# Altium schematic sheet Microphone PreAmp.SchDoc
size A4; SheetNumber: 3; SheetTotal: 3
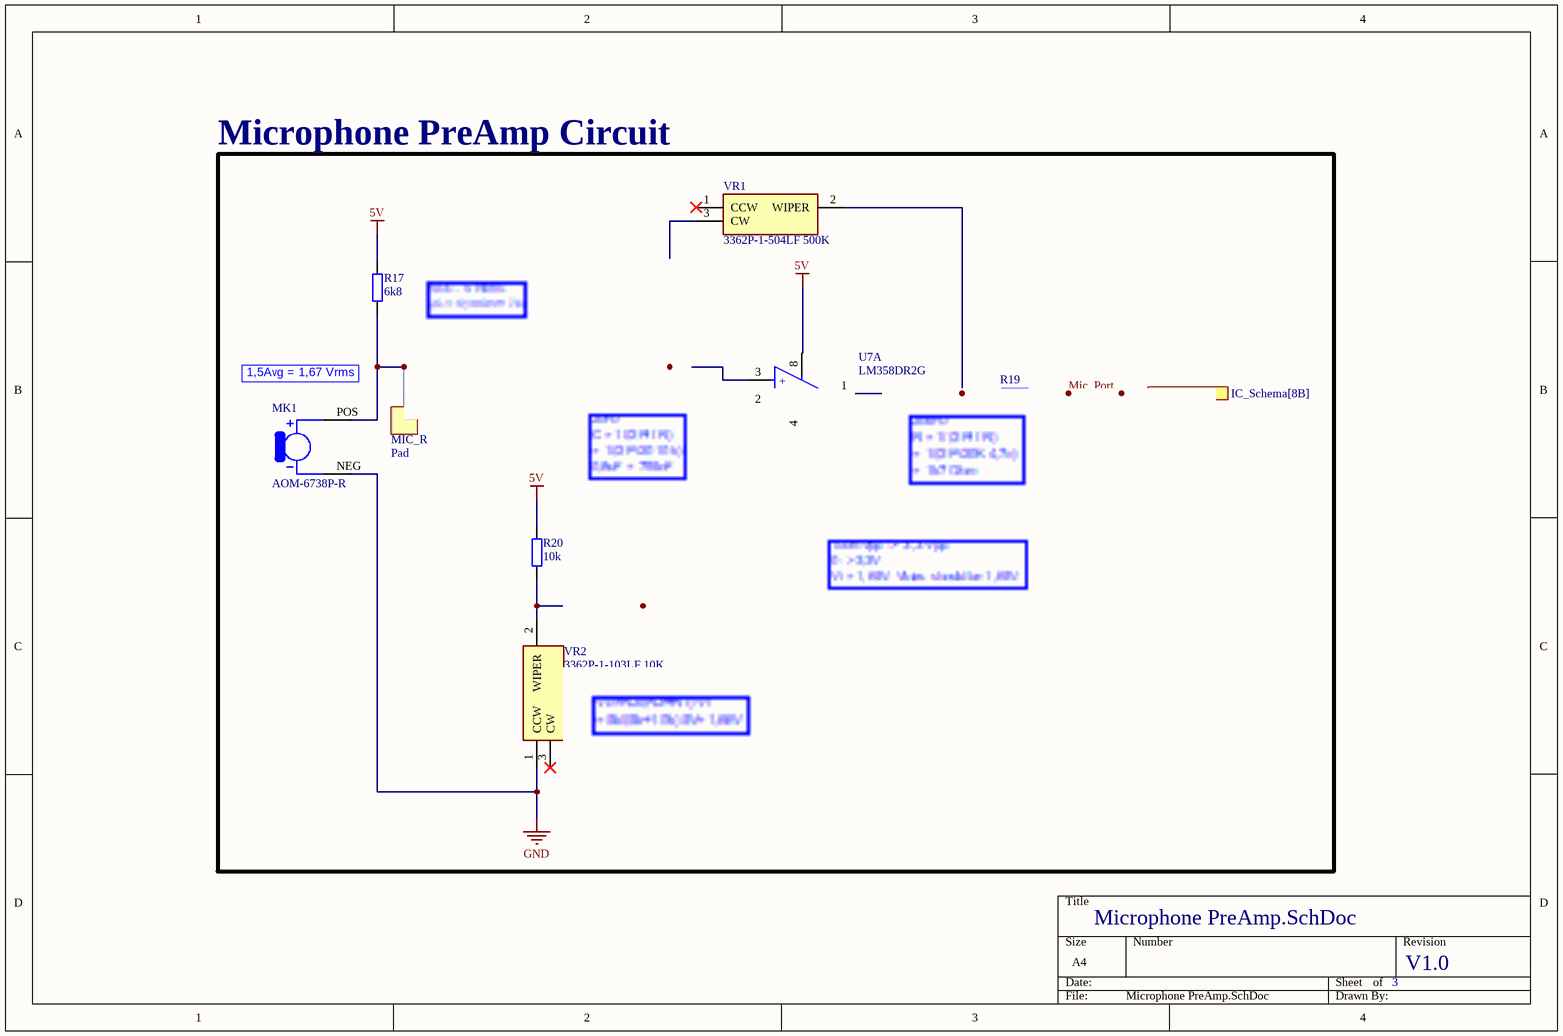
[diagram p0: Microphone PreAmp.SchDoc]

## Parts
Bias  Pad  [PAD_SQ_2MM]
C13  4u7  [CAP_0603]
C14  4n7  [CAP_0603]
MIC_O  Pad  [PAD_SQ_2MM]
MIC_R  Pad  [PAD_SQ_2MM]
MK1  AOM-6738P-R  [MIC_AOM-6738P-R]
R17  6k8  [RES_1206]
R18  10k  [RES_1206]
R19  1k7  [RES_1206]
R20  10k  [RES_1206]
U7  LM358DR2G  [FP-751-07-IPC_C]  (part A of 2)
VR1  3362P-1-504LF 500K  [3362P1504LF]
VR2  3362P-1-103LF 10K  [3362P1504LF]

## Blocks framed on the sheet
Microphone PreAmp Circuit: Bias C13 C14 MIC_O MIC_R MK1 R17-R20 U7 VR1 VR2

## Ports
Mic_Port (see IC_Schema[8B])

## Nets
5V: R17.1 R20.2 U7.8(VCC)
GND: C14.2 MK1.NEG U7.4(VEE/GND) VR2.1(CCW)
Mic_Port: C14.1 MIC_O.1 R19.1 ; port Mic_Port
NetBias_1: Bias.1 R20.1 U7.2(INPUT_A-) VR2.2(WIPER)
NetC13_1: C13.1 R18.2
NetC13_2: C13.2 MIC_R.1 MK1.POS R17.2
NetR18_1: R18.1 U7.3(INPUT_A+) VR1.3(CW)
NetR19_2: R19.2 U7.1(OUTPUT_A) VR1.2(WIPER)

Not connected (* = marked no-connect by the designer): VR1 1(CCW)*; VR2 3(CW)*

## Notes on the sheet
- V1.0
- (in symbol CMP-1310-00291-2, part A) +; -

## Library data of the parts
Bias MIC_O MIC_R = PAD_SQ_2MM: Test Point Square 2mm
C13 C14 = CAP_0603_50V: Capacitor SMD 0603 50V
MK1 = AOM-6738P-R: 30Hz ~ 15kHz Analog Microphone Electret Condenser 1.5V ~ 10V Omnidirectional _-38dB Â±3dB_ PC Pins; MF: PUI; SnapEDA_Link: https://www.snapeda.com/parts/AOM-6738P-R/PUI%20Audio%2C%20Inc./view-part/246102/?ref=snap; Package: PUI; MP: AOM-6738P-R; Value: *; Availability: Unavailable; Price: None
R17-R20 = RES_1206: Resistor SMD 1206
U7 = CMP-1310-00291-2: IC OPAMP GP 2 CIRCUIT 8SOIC; Gain Bandwidth Product: 1MHz; Number of Circuits: 2; Min Supply Voltage: 3V; Slew Rate: 0.6V/µs; Max Dual Supply Voltage: 16V; Common Mode Rejection Ratio: 65dB; Input Bias Current: 250nA; Min Dual Supply Voltage: 1.5V; Dual Supply Voltage: 9V; Operating Supply Current: 1.5mA; Output Current: 40mA; Input Offset Voltage (Vos): 7mV; Nominal Supply Current: 1.2mA; Voltage Gain: 100dB; Max Supply Voltage: 32V; Width: 4mm; Number of Pins: 8; Min Operating Temperature: 0°C; REACH SVHC: No SVHC; Contact Plating: Tin; Lead Free: Lead Free; Halogen Free: Halogen Free; Power Supply Rejection Ratio (PSRR): 65dB; Operating Supply Voltage: 16V; Package Quantity: 2500; Max Operating Temperature: 70°C; Case/Package: SOIC; Height: 1.5mm; Packaging: Tape and Reel; Radiation Hardening: No; Number of Channels: 2; Bandwidth: 1MHz; Length: 5mm; Number of Elements: 2; Number of Amplifiers: 2; Output Current per Channel: 40mA
VR1 VR2 = 3362P-1-504LF: Variable Resistor; Manufacturer_Name: Bourns; Datasheet Link: https://componentsearchengine.com/Datasheets/2/3362P-1-504LF.pdf; Height: 4.95mm; Manufacturer_Part_Number: 3362P-1-504LF; Mouser Part Number: 652-3362P-1-504LF; Mouser Price/Stock: https://www.mouser.co.uk/ProductDetail/Bourns/3362P-1-504LF?qs=PcXFNxoHkaI%252Brk7xgs916g%3D%3D; Arrow Part Number: 3362P-1-504LF; Arrow Price/Stock: https://www.arrow.com/en/products/3362p-1-504lf/bourns?region=nac